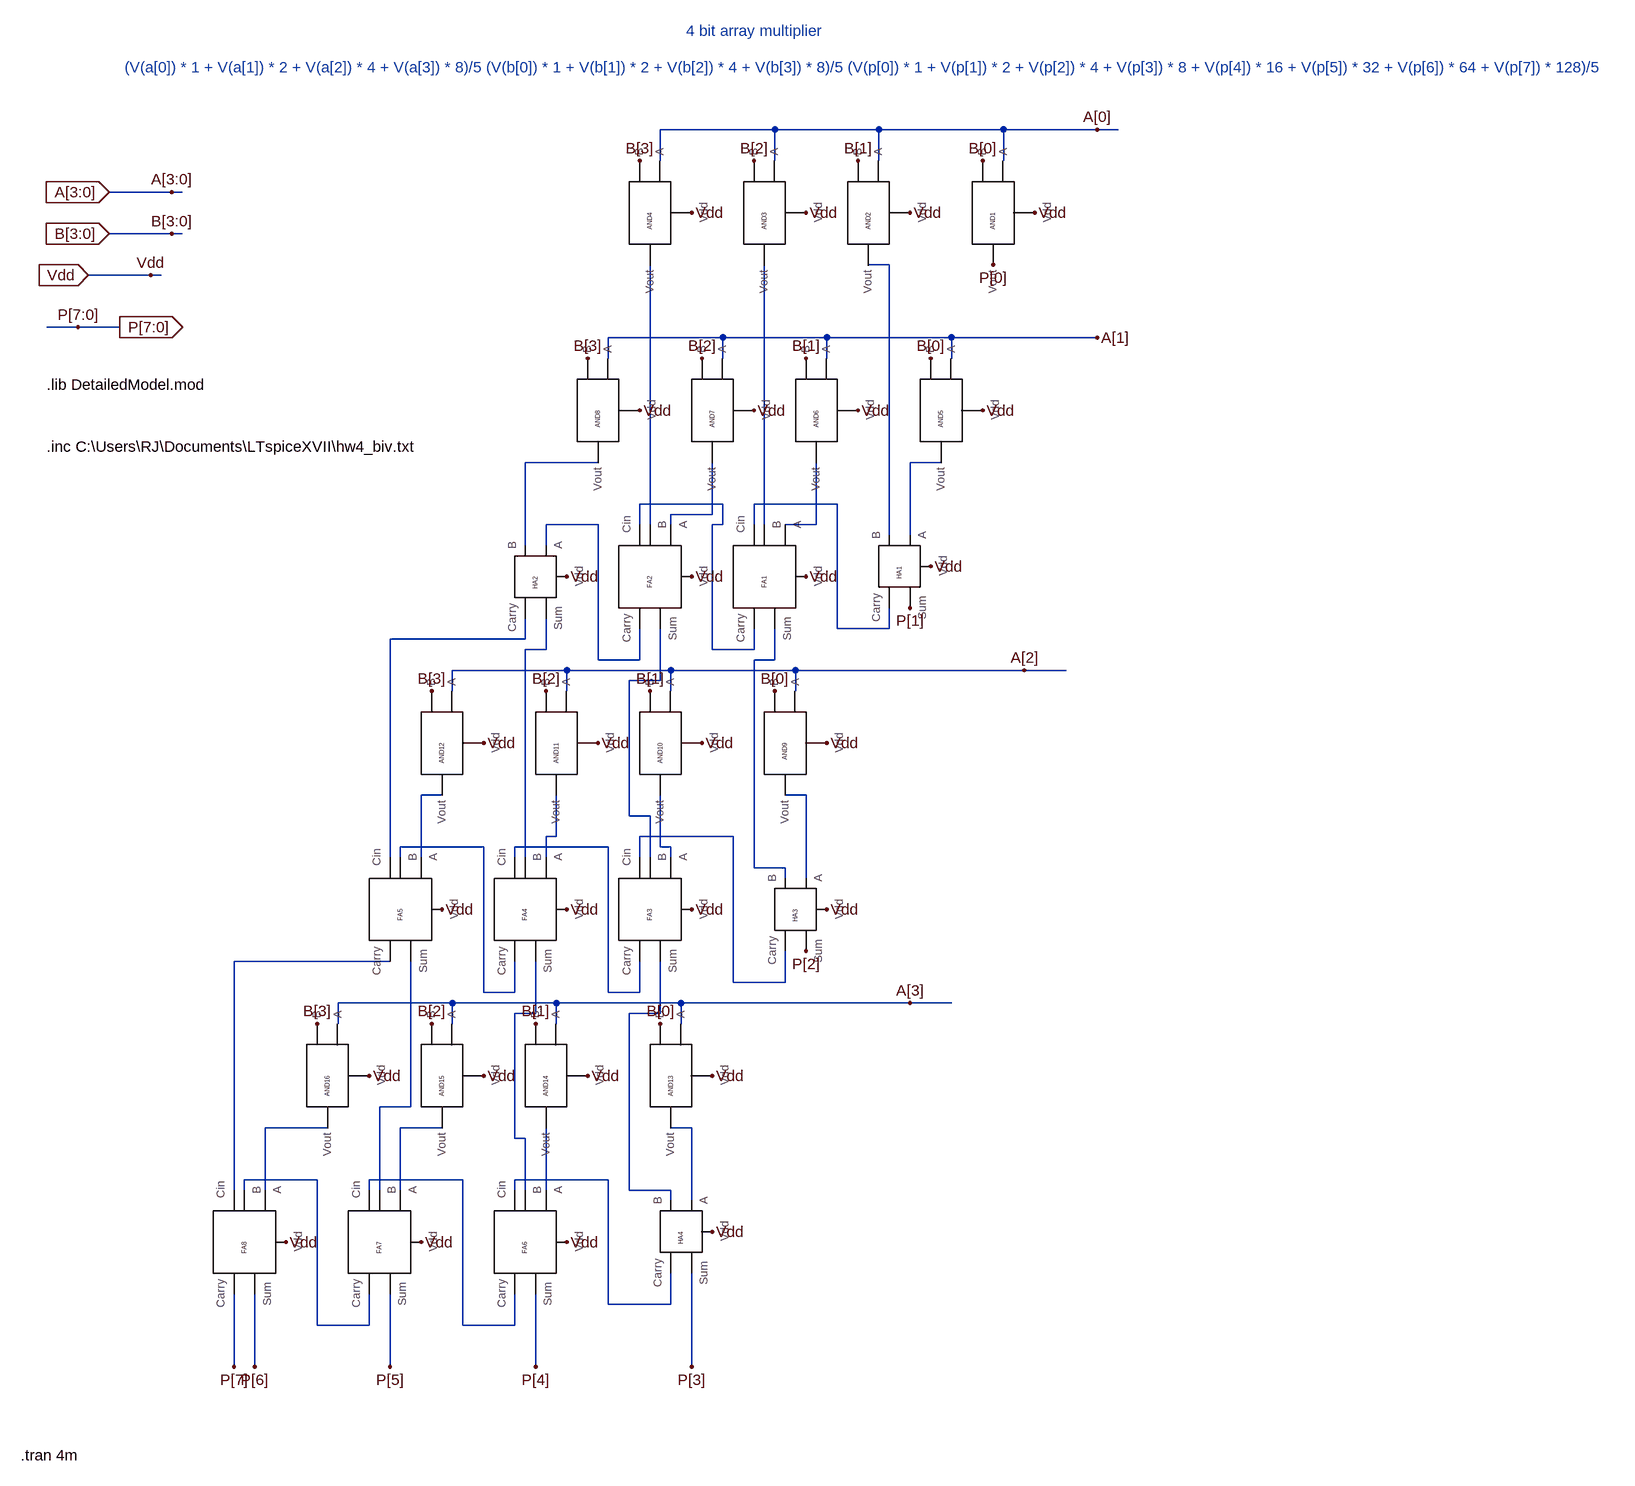
[diagram p0: schematic array_multiplier.asc]
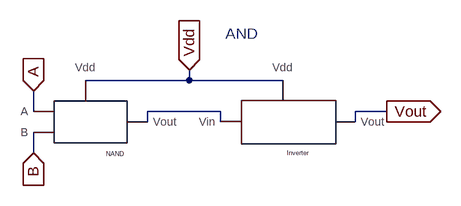
[diagram p1: sub-circuit my_and.asc]
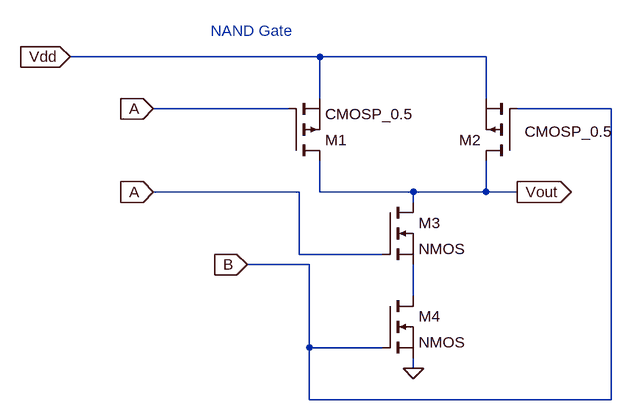
[diagram p2: sub-circuit my_nand.asc]
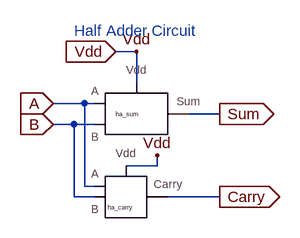
[diagram p3: sub-circuit ha.asc]
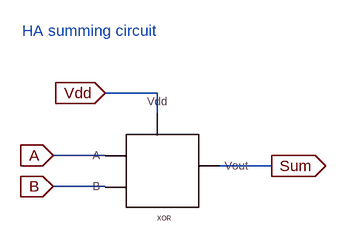
[diagram p4: sub-circuit ha_sum.asc]
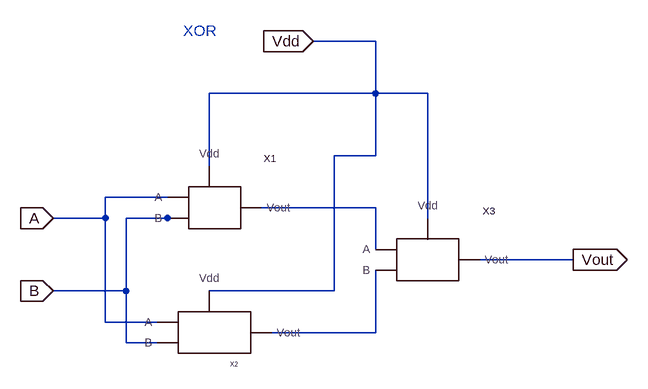
[diagram p5: sub-circuit my_xor.asc]
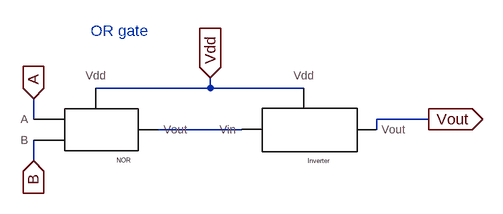
[diagram p6: sub-circuit my_or.asc]
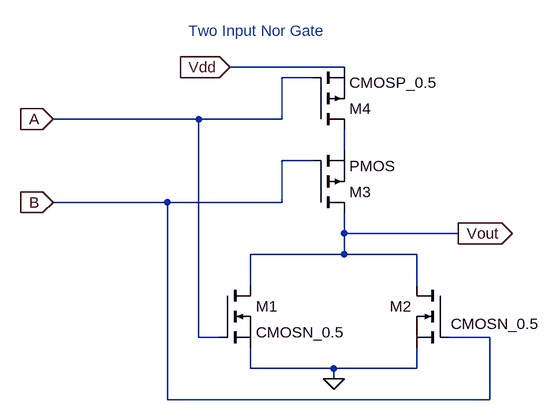
[diagram p7: sub-circuit my_nor.asc]
array_multiplier.asc, the LTspice schematic file:
Version 4
SHEET 1 1696 2024
WIRE -16 -32 -192 -32
WIRE 144 -32 -16 -32
WIRE 336 -32 144 -32
WIRE 480 -32 336 -32
WIRE 512 -32 480 -32
WIRE -192 16 -192 -32
WIRE -16 16 -16 -32
WIRE 144 16 144 -32
WIRE 336 16 336 -32
WIRE -944 64 -1040 64
WIRE -928 64 -944 64
WIRE -944 128 -1040 128
WIRE -928 128 -944 128
WIRE 160 176 128 176
WIRE -976 192 -1072 192
WIRE -960 192 -976 192
WIRE -1088 272 -1136 272
WIRE -1024 272 -1088 272
WIRE -96 288 -272 288
WIRE 64 288 -96 288
WIRE 256 288 64 288
WIRE 480 288 256 288
WIRE -272 320 -272 288
WIRE -96 320 -96 288
WIRE 64 320 64 288
WIRE 256 320 256 288
WIRE -288 480 -400 480
WIRE 240 480 192 480
WIRE -96 544 -224 544
WIRE 80 544 -48 544
WIRE -112 560 -112 480
WIRE -112 560 -176 560
WIRE -288 576 -368 576
WIRE -224 576 -224 544
WIRE -208 576 -208 176
WIRE -176 576 -176 560
WIRE -96 576 -96 544
WIRE -96 576 -112 576
WIRE -48 576 -48 544
WIRE -32 576 -32 176
WIRE 48 576 48 480
WIRE 48 576 0 576
WIRE 160 592 160 176
WIRE 192 592 192 480
WIRE -400 608 -400 480
WIRE -368 608 -368 576
WIRE 80 736 80 544
WIRE 160 736 160 704
WIRE 160 736 80 736
WIRE -400 752 -400 720
WIRE -400 752 -608 752
WIRE -368 768 -368 720
WIRE -368 768 -400 768
WIRE -112 768 -112 576
WIRE -48 768 -48 736
WIRE -48 768 -112 768
WIRE -288 784 -288 576
WIRE -224 784 -224 736
WIRE -224 784 -288 784
WIRE -16 784 -16 736
WIRE -16 784 -48 784
WIRE -336 800 -512 800
WIRE -176 800 -336 800
WIRE 16 800 -176 800
WIRE 368 800 16 800
WIRE 432 800 368 800
WIRE -192 816 -192 736
WIRE -192 816 -240 816
WIRE -512 832 -512 800
WIRE -336 832 -336 800
WIRE -176 832 -176 800
WIRE 16 832 16 800
WIRE -528 992 -560 992
WIRE 32 992 0 992
WIRE -240 1024 -240 816
WIRE -208 1024 -240 1024
WIRE -352 1056 -352 992
WIRE -352 1056 -368 1056
WIRE -80 1056 -224 1056
WIRE -464 1072 -592 1072
WIRE -272 1072 -416 1072
WIRE -192 1072 -192 992
WIRE -176 1072 -192 1072
WIRE -608 1088 -608 752
WIRE -592 1088 -592 1072
WIRE -560 1088 -560 992
WIRE -416 1088 -416 1072
WIRE -400 1088 -400 768
WIRE -368 1088 -368 1056
WIRE -224 1088 -224 1056
WIRE -208 1088 -208 1024
WIRE -176 1088 -176 1072
WIRE -48 1104 -48 784
WIRE 0 1104 -48 1104
WIRE 0 1120 0 1104
WIRE 32 1120 32 992
WIRE -608 1248 -848 1248
WIRE -80 1280 -80 1056
WIRE 0 1280 0 1232
WIRE 0 1280 -80 1280
WIRE -464 1296 -464 1072
WIRE -416 1296 -416 1248
WIRE -416 1296 -464 1296
WIRE -272 1296 -272 1072
WIRE -224 1296 -224 1248
WIRE -224 1296 -272 1296
WIRE -512 1312 -688 1312
WIRE -352 1312 -512 1312
WIRE -160 1312 -352 1312
WIRE 192 1312 -160 1312
WIRE 256 1312 192 1312
WIRE -384 1328 -384 1248
WIRE -384 1328 -416 1328
WIRE -192 1328 -192 1248
WIRE -192 1328 -240 1328
WIRE -688 1344 -688 1312
WIRE -512 1344 -512 1312
WIRE -352 1344 -352 1312
WIRE -160 1344 -160 1312
WIRE -576 1472 -576 1248
WIRE -576 1472 -624 1472
WIRE -704 1504 -800 1504
WIRE -528 1504 -592 1504
WIRE -144 1504 -176 1504
WIRE -416 1520 -416 1328
WIRE -400 1520 -416 1520
WIRE -720 1584 -832 1584
WIRE -496 1584 -640 1584
WIRE -272 1584 -416 1584
WIRE -848 1600 -848 1248
WIRE -832 1600 -832 1584
WIRE -800 1600 -800 1504
WIRE -640 1600 -640 1584
WIRE -624 1600 -624 1472
WIRE -592 1600 -592 1504
WIRE -416 1600 -416 1584
WIRE -400 1600 -400 1520
WIRE -368 1600 -368 1504
WIRE -240 1600 -240 1328
WIRE -176 1600 -240 1600
WIRE -176 1616 -176 1600
WIRE -144 1616 -144 1504
WIRE -272 1776 -272 1584
WIRE -176 1776 -176 1728
WIRE -176 1776 -272 1776
WIRE -720 1808 -720 1584
WIRE -640 1808 -640 1760
WIRE -640 1808 -720 1808
WIRE -496 1808 -496 1584
WIRE -416 1808 -416 1760
WIRE -416 1808 -496 1808
WIRE -848 1872 -848 1760
WIRE -816 1872 -816 1760
WIRE -608 1872 -608 1760
WIRE -384 1872 -384 1760
WIRE -144 1872 -144 1728
FLAG -1040 64 A[3:0]
IOPIN -1040 64 In
FLAG -944 64 A[3:0]
FLAG -1040 128 B[3:0]
IOPIN -1040 128 In
FLAG -944 128 B[3:0]
FLAG -1088 272 P[7:0]
FLAG -1024 272 P[7:0]
IOPIN -1024 272 Out
FLAG 480 -32 A[0]
FLAG 304 16 B[0]
FLAG 112 16 B[1]
FLAG -48 16 B[2]
FLAG -224 16 B[3]
FLAG 480 288 A[1]
FLAG 320 176 P[0]
FLAG -304 320 B[3]
FLAG -128 320 B[2]
FLAG 32 320 B[1]
FLAG 224 320 B[0]
FLAG 192 704 P[1]
FLAG 368 800 A[2]
FLAG -544 832 B[3]
FLAG -368 832 B[2]
FLAG -208 832 B[1]
FLAG -16 832 B[0]
FLAG 192 1312 A[3]
FLAG -720 1344 B[3]
FLAG -544 1344 B[2]
FLAG -384 1344 B[1]
FLAG -192 1344 B[0]
FLAG 32 1232 P[2]
FLAG -848 1872 P[7]
FLAG -816 1872 P[6]
FLAG -144 1872 P[3]
FLAG -608 1872 P[5]
FLAG -384 1872 P[4]
FLAG -768 1680 Vdd
FLAG -560 1680 Vdd
FLAG -336 1680 Vdd
FLAG -112 1664 Vdd
FLAG -112 1424 Vdd
FLAG -304 1424 Vdd
FLAG -464 1424 Vdd
FLAG -640 1424 Vdd
FLAG -528 1168 Vdd
FLAG -336 1168 Vdd
FLAG -144 1168 Vdd
FLAG 64 1168 Vdd
FLAG 64 912 Vdd
FLAG -128 912 Vdd
FLAG -288 912 Vdd
FLAG -464 912 Vdd
FLAG -336 656 Vdd
FLAG -144 656 Vdd
FLAG 32 656 Vdd
FLAG 224 640 Vdd
FLAG 304 400 Vdd
FLAG 112 400 Vdd
FLAG -48 400 Vdd
FLAG -224 400 Vdd
FLAG -144 96 Vdd
FLAG 32 96 Vdd
FLAG 192 96 Vdd
FLAG 384 96 Vdd
FLAG -1072 192 Vdd
IOPIN -1072 192 In
FLAG -976 192 Vdd
SYMBOL my_and 320 96 R90
WINDOW 0 0 0 Left 0
SYMATTR InstName AND1
SYMBOL my_and 128 96 R90
WINDOW 0 0 0 Left 0
SYMATTR InstName AND2
SYMBOL my_and -32 96 R90
WINDOW 0 0 0 Left 0
SYMATTR InstName AND3
SYMBOL my_and -208 96 R90
WINDOW 0 0 0 Left 0
SYMATTR InstName AND4
SYMBOL my_and 240 400 R90
WINDOW 0 0 0 Left 0
SYMATTR InstName AND5
SYMBOL my_and 48 400 R90
WINDOW 0 0 0 Left 0
SYMATTR InstName AND6
SYMBOL my_and -112 400 R90
WINDOW 0 0 0 Left 0
SYMATTR InstName AND7
SYMBOL my_and -288 400 R90
WINDOW 0 0 0 Left 0
SYMATTR InstName AND8
SYMBOL ha 176 640 R90
WINDOW 0 0 0 Left 0
SYMATTR InstName HA1
SYMBOL ha 16 1168 R90
WINDOW 0 0 0 Left 0
SYMATTR InstName HA3
SYMBOL fa -32 656 R90
WINDOW 0 0 0 Left 0
SYMATTR InstName FA1
SYMBOL fa -208 656 R90
WINDOW 0 0 0 Left 0
SYMATTR InstName FA2
SYMBOL fa -208 1168 R90
WINDOW 0 0 0 Left 0
SYMATTR InstName FA3
SYMBOL fa -400 1168 R90
WINDOW 0 0 0 Left 0
SYMATTR InstName FA4
SYMBOL fa -592 1168 R90
WINDOW 0 0 0 Left 0
SYMATTR InstName FA5
SYMBOL my_and 0 912 R90
WINDOW 0 0 0 Left 0
SYMATTR InstName AND9
SYMBOL my_and -192 912 R90
WINDOW 0 0 0 Left 0
SYMATTR InstName AND10
SYMBOL my_and -352 912 R90
WINDOW 0 0 0 Left 0
SYMATTR InstName AND11
SYMBOL my_and -528 912 R90
WINDOW 0 0 0 Left 0
SYMATTR InstName AND12
SYMBOL ha -384 656 R90
WINDOW 0 0 0 Left 0
SYMATTR InstName HA2
SYMBOL my_and -176 1424 R90
WINDOW 0 0 0 Left 0
SYMATTR InstName AND13
SYMBOL my_and -368 1424 R90
WINDOW 0 0 0 Left 0
SYMATTR InstName AND14
SYMBOL my_and -528 1424 R90
WINDOW 0 0 0 Left 0
SYMATTR InstName AND15
SYMBOL my_and -704 1424 R90
WINDOW 0 0 0 Left 0
SYMATTR InstName AND16
SYMBOL ha -160 1664 R90
WINDOW 0 0 0 Left 0
SYMATTR InstName HA4
SYMBOL fa -400 1680 R90
WINDOW 0 0 0 Left 0
SYMATTR InstName FA6
SYMBOL fa -624 1680 R90
WINDOW 0 0 0 Left 0
SYMATTR InstName FA7
SYMBOL fa -832 1680 R90
WINDOW 0 0 0 Left 0
SYMATTR InstName FA8
TEXT -152 -184 Left 2 ;4 bit array multiplier
TEXT -1136 360 Left 2 !.lib DetailedModel.mod
TEXT -1136 456 Left 2 !.inc C:\\Users\\RJ\\Documents\\LTspiceXVII\\hw4_biv.txt
TEXT -1176 2008 Left 2 !.tran 4m
TEXT -1016 -128 Left 2 ;(V(a[0]) * 1 + V(a[1]) * 2 + V(a[2]) * 4 + V(a[3]) * 8)/5 (V(b[0]) * 1 + V(b[1]) * 2 + V(b[2]) * 4 + V(b[3]) * 8)/5 (V(p[0]) * 1 + V(p[1]) * 2 + V(p[2]) * 4 + V(p[3]) * 8 + V(p[4]) * 16 + V(p[5]) * 32 + V(p[6]) * 64 + V(p[7]) * 128)/5

my_and.asc, the sub-circuit schematic file:
Version 4
SHEET 1 880 680
WIRE 288 112 288 96
WIRE 288 112 128 112
WIRE 432 112 288 112
WIRE 48 160 48 128
WIRE 336 160 224 160
WIRE 592 160 544 160
WIRE 224 176 224 160
WIRE 336 176 336 160
WIRE 544 176 544 160
WIRE 48 224 48 192
FLAG 48 128 A
IOPIN 48 128 In
FLAG 48 224 B
IOPIN 48 224 In
FLAG 288 96 Vdd
IOPIN 288 96 In
FLAG 592 160 Vout
IOPIN 592 160 Out
SYMBOL my_nand 128 176 R0
SYMATTR InstName NAND
SYMBOL my_inverter 432 176 R0
SYMATTR InstName Inverter
TEXT 344 40 Left 2 ;AND

my_nand.asc, the sub-circuit schematic file:
Version 4
SHEET 1 932 680
WIRE 480 -16 96 -16
WIRE 736 -16 480 -16
WIRE 480 48 480 -16
WIRE 736 48 736 -16
WIRE 432 64 224 64
WIRE 928 64 784 64
WIRE 448 192 224 192
WIRE 480 192 480 144
WIRE 624 192 480 192
WIRE 736 192 736 144
WIRE 736 192 624 192
WIRE 784 192 736 192
WIRE 624 208 624 192
WIRE 448 288 448 192
WIRE 576 288 448 288
WIRE 464 304 368 304
WIRE 624 352 624 304
WIRE 464 432 464 304
WIRE 576 432 464 432
WIRE 624 464 624 448
WIRE 464 512 464 432
WIRE 928 512 928 64
WIRE 928 512 464 512
FLAG 624 464 0
FLAG 96 -16 Vdd
IOPIN 96 -16 In
FLAG 224 64 A
IOPIN 224 64 In
FLAG 224 192 A
IOPIN 224 192 In
FLAG 368 304 B
IOPIN 368 304 In
FLAG 784 192 Vout
IOPIN 784 192 Out
SYMBOL pmos 432 144 M180
SYMATTR InstName M1
SYMATTR Value CMOSP_0.5
SYMBOL pmos 784 144 R180
WINDOW 3 -11 45 Right 2
SYMATTR Value CMOSP_0.5
SYMATTR InstName M2
SYMBOL nmos 576 208 R0
SYMATTR InstName M3
SYMBOL nmos 576 352 R0
SYMATTR InstName M4
TEXT 312 -56 Left 2 ;NAND Gate

ha.asc, the sub-circuit schematic file:
Version 4
SHEET 1 880 680
WIRE 256 48 224 48
WIRE 256 96 256 48
WIRE 176 128 128 128
WIRE 192 128 176 128
WIRE 384 144 336 144
WIRE 160 160 128 160
WIRE 192 160 160 160
WIRE 288 224 288 208
WIRE 288 224 240 224
WIRE 176 256 176 128
WIRE 192 256 176 256
WIRE 160 272 160 160
WIRE 192 272 160 272
WIRE 384 272 304 272
FLAG 128 128 A
IOPIN 128 128 In
FLAG 128 160 B
IOPIN 128 160 In
FLAG 224 48 Vdd
IOPIN 224 48 In
FLAG 384 144 Sum
IOPIN 384 144 Out
FLAG 384 272 Carry
IOPIN 384 272 Out
FLAG 256 48 Vdd
FLAG 288 208 Vdd
SYMBOL ha_sum 256 144 R0
SYMATTR InstName ha_sum
SYMBOL ha_carry 240 272 R0
SYMATTR InstName ha_carry
TEXT 160 16 Left 2 ;Half Adder Circuit

ha_sum.asc, the sub-circuit schematic file:
Version 4
SHEET 1 880 680
WIRE 208 0 128 0
WIRE 208 32 208 0
WIRE 128 96 48 96
WIRE 384 112 304 112
WIRE 128 144 48 144
FLAG 48 96 A
IOPIN 48 96 In
FLAG 48 144 B
IOPIN 48 144 In
FLAG 128 0 Vdd
IOPIN 128 0 In
FLAG 384 112 Sum
IOPIN 384 112 Out
SYMBOL my_xor 208 112 R0
SYMATTR InstName XOR
TEXT 0 -96 Left 2 ;HA summing circuit

my_xor.asc, the sub-circuit schematic file:
Version 4
SHEET 1 1232 680
WIRE 592 -160 496 -160
WIRE 592 -80 592 -160
WIRE 592 -80 336 -80
WIRE 672 -80 592 -80
WIRE 592 16 592 -80
WIRE 592 16 528 16
WIRE 336 32 336 -80
WIRE 272 80 176 80
WIRE 592 96 416 96
WIRE 176 112 176 80
WIRE 176 112 96 112
WIRE 272 112 208 112
WIRE 288 112 272 112
WIRE 672 112 672 -80
WIRE 592 160 592 96
WIRE 896 176 752 176
WIRE 208 224 208 112
WIRE 208 224 96 224
WIRE 528 224 528 16
WIRE 528 224 336 224
WIRE 176 272 176 112
WIRE 256 272 176 272
WIRE 592 288 592 192
WIRE 592 288 432 288
WIRE 208 304 208 224
WIRE 256 304 208 304
FLAG 96 112 A
IOPIN 96 112 In
FLAG 96 224 B
IOPIN 96 224 In
FLAG 496 -160 Vdd
IOPIN 496 -160 In
FLAG 896 176 Vout
IOPIN 896 176 Out
SYMBOL my_or 336 80 R0
SYMATTR InstName X1
SYMBOL my_nand 336 288 R0
SYMATTR InstName X2
SYMBOL my_and 672 176 R0
SYMATTR InstName X3
TEXT 296 -176 Left 2 ;XOR

my_or.asc, the sub-circuit schematic file:
Version 4
SHEET 1 880 680
WIRE 288 144 288 128
WIRE 288 144 112 144
WIRE 432 144 288 144
WIRE 16 192 16 160
WIRE 624 192 544 192
WIRE 336 208 208 208
WIRE 544 208 544 192
WIRE 16 256 16 224
FLAG 16 160 A
IOPIN 16 160 In
FLAG 16 256 B
IOPIN 16 256 In
FLAG 288 128 Vdd
IOPIN 288 128 In
FLAG 624 192 Vout
IOPIN 624 192 Out
SYMBOL my_nor 112 208 R0
SYMATTR InstName NOR
SYMBOL my_inverter 432 208 R0
SYMATTR InstName Inverter
TEXT 104 56 Left 2 ;OR gate

my_nor.asc, the sub-circuit schematic file:
Version 4
SHEET 1 880 680
WIRE 336 -240 160 -240
WIRE 288 -224 240 -224
WIRE 112 -160 -112 -160
WIRE 240 -160 240 -224
WIRE 240 -160 112 -160
WIRE 336 -112 336 -144
WIRE 288 -96 240 -96
WIRE 64 -32 -112 -32
WIRE 240 -32 240 -96
WIRE 240 -32 64 -32
WIRE 336 16 336 -16
WIRE 512 16 336 16
WIRE 336 48 336 16
WIRE 336 48 192 48
WIRE 448 48 336 48
WIRE 192 96 192 48
WIRE 448 96 448 48
WIRE 112 176 112 -160
WIRE 144 176 112 176
WIRE 560 176 496 176
WIRE 192 224 192 192
WIRE 320 224 192 224
WIRE 448 224 448 192
WIRE 448 224 320 224
WIRE 320 240 320 224
WIRE 64 272 64 -32
WIRE 560 272 560 176
WIRE 560 272 64 272
FLAG -112 -32 B
IOPIN -112 -32 In
FLAG -112 -160 A
IOPIN -112 -160 In
FLAG 160 -240 Vdd
IOPIN 160 -240 In
FLAG 512 16 Vout
IOPIN 512 16 Out
FLAG 320 240 0
SYMBOL nmos 144 96 R0
SYMATTR InstName M1
SYMATTR Value CMOSN_0.5
SYMBOL nmos 496 96 M0
WINDOW 3 -141 59 Left 2
SYMATTR Value CMOSN_0.5
SYMATTR InstName M2
SYMBOL pmos 288 -144 M180
SYMATTR InstName M4
SYMATTR Value CMOSP_0.5
SYMBOL pmos 288 -16 M180
SYMATTR InstName M3
TEXT 96 -296 Left 2 ;Two Input Nor Gate

ha_carry.asc, the sub-circuit schematic file:
Version 4
SHEET 1 880 680
WIRE 192 -32 144 -32
WIRE 192 -16 192 -32
WIRE 112 32 48 32
WIRE 368 48 272 48
WIRE 112 64 48 64
FLAG 48 32 A
IOPIN 48 32 In
FLAG 48 64 B
IOPIN 48 64 In
FLAG 144 -32 Vdd
IOPIN 144 -32 In
FLAG 368 48 Carry
IOPIN 368 48 Out
SYMBOL my_and 192 48 R0
WINDOW 0 0 0 Left 0
SYMATTR InstName AND1
TEXT 120 -96 Left 2 ;HA carry circuit

fa.asc, the sub-circuit schematic file:
Version 4
SHEET 1 880 680
WIRE 128 -32 80 -32
WIRE 176 -32 128 -32
WIRE 176 16 176 -32
WIRE 176 32 176 16
WIRE 80 48 16 48
WIRE 112 48 80 48
WIRE 304 64 256 64
WIRE 64 80 32 80
WIRE 112 80 64 80
WIRE 112 96 48 96
WIRE 32 112 32 80
WIRE 32 112 16 112
WIRE 48 176 48 96
WIRE 48 176 16 176
WIRE 208 176 208 160
WIRE 208 176 160 176
WIRE 80 208 80 48
WIRE 112 208 80 208
WIRE 304 224 240 224
WIRE 64 240 64 80
WIRE 112 240 64 240
WIRE 48 256 48 176
WIRE 112 256 48 256
FLAG 16 48 A
IOPIN 16 48 In
FLAG 16 112 B
IOPIN 16 112 In
FLAG 16 176 Cin
IOPIN 16 176 In
FLAG 80 -32 Vdd
IOPIN 80 -32 In
FLAG 128 -32 Vdd
FLAG 208 160 Vdd
FLAG 304 64 Sum
IOPIN 304 64 Out
FLAG 304 224 Carry
IOPIN 304 224 Out
SYMBOL fa_sum 160 64 R0
SYMATTR InstName fa_sum
SYMBOL fa_carry 160 224 R0
SYMATTR InstName fa_carry
TEXT 160 -80 Left 2 ;Full Adder Circuit

fa_sum.asc, the sub-circuit schematic file:
Version 4
SHEET 1 880 680
WIRE 320 32 128 32
WIRE 320 96 320 32
WIRE 320 96 176 96
WIRE 112 128 64 128
WIRE 112 160 64 160
WIRE 320 176 320 96
WIRE 352 176 320 176
WIRE 256 208 256 144
WIRE 288 208 256 208
WIRE 464 224 432 224
WIRE 288 240 80 240
FLAG 64 128 A
IOPIN 64 128 In
FLAG 64 160 B
IOPIN 64 160 In
FLAG 80 240 Cin
IOPIN 80 240 In
FLAG 464 224 Sum
IOPIN 464 224 Out
FLAG 128 32 Vdd
IOPIN 128 32 In
SYMBOL ha_sum 176 144 R0
SYMATTR InstName HA_sum1
SYMBOL ha_sum 352 224 R0
SYMATTR InstName HA_sum2
TEXT 168 -72 Left 2 ;FA summing circuit

fa_carry.asc, the sub-circuit schematic file:
Version 4
SHEET 1 1564 680
WIRE 32 96 -16 96
WIRE 192 128 112 128
WIRE 576 144 496 144
WIRE 96 192 16 192
WIRE 384 192 304 192
WIRE 416 192 384 192
WIRE 512 192 416 192
WIRE 752 208 656 208
WIRE 512 224 384 224
WIRE 128 288 112 288
WIRE 192 288 128 288
WIRE 576 304 496 304
WIRE 1072 304 816 304
WIRE 752 336 752 208
WIRE 96 352 16 352
WIRE 384 352 384 224
WIRE 384 352 304 352
WIRE 512 352 384 352
WIRE 752 368 656 368
WIRE 512 384 432 384
WIRE 192 448 112 448
WIRE 1072 448 1072 304
WIRE 1232 448 1072 448
WIRE 592 464 496 464
WIRE 1072 464 1072 448
WIRE 1072 464 992 464
WIRE 896 496 896 352
WIRE 928 496 896 496
WIRE 96 512 16 512
WIRE 320 512 304 512
WIRE 432 512 432 384
WIRE 432 512 320 512
WIRE 528 512 432 512
WIRE 1136 512 1072 512
WIRE 1440 512 1344 512
WIRE 928 528 672 528
WIRE 416 544 416 192
WIRE 528 544 416 544
FLAG 16 192 A
IOPIN 16 192 In
FLAG 16 352 B
IOPIN 16 352 In
FLAG 16 512 Cin
IOPIN 16 512 In
FLAG 304 352 Bbar
FLAG 384 192 Abar
FLAG 320 512 Cbar
FLAG 1440 512 Carry
IOPIN 1440 512 Out
FLAG -16 96 Vdd
IOPIN -16 96 In
FLAG 1072 304 Vdd
FLAG 496 144 Vdd
FLAG 496 304 Vdd
FLAG 496 464 Vdd
FLAG 112 448 Vdd
FLAG 128 288 Vdd
FLAG 112 128 Vdd
FLAG 32 96 Vdd
SYMBOL my_inverter 192 192 R0
SYMATTR InstName inverter1
SYMBOL my_inverter 192 352 R0
SYMATTR InstName inverter2
SYMBOL my_inverter 192 512 R0
SYMATTR InstName inverter3
SYMBOL my_or 576 192 R0
WINDOW 0 0 0 Left 0
SYMATTR InstName or1
SYMBOL my_or 576 352 R0
WINDOW 0 0 0 Left 0
SYMATTR InstName or2
SYMBOL my_or 592 512 R0
WINDOW 0 0 0 Left 0
SYMATTR InstName or3
SYMBOL ha_sum 816 352 R0
SYMATTR InstName ha_sum1
SYMBOL ha_sum 992 512 R0
SYMATTR InstName ha_sum2
SYMBOL my_inverter 1232 512 R0
SYMATTR InstName inverter4
TEXT 824 144 Left 2 ;FA carry circuit

The netlist it stands for:
* array_multiplier.asc
XAND1 A[0] B[0] P[0] Vdd my_and
XAND2 A[0] B[1] N001 Vdd my_and
XAND3 A[0] B[2] N009 Vdd my_and
XAND4 A[0] B[3] N008 Vdd my_and
XAND5 A[1] B[0] N003 Vdd my_and
XAND6 A[1] B[1] N010 Vdd my_and
XAND7 A[1] B[2] N006 Vdd my_and
XAND8 A[1] B[3] N002 Vdd my_and
XHA1 N003 N001 Vdd P[1] N005 ha
XHA3 N016 N013 Vdd P[2] N018 ha
XFA1 N010 N009 N005 N013 N004 Vdd fa
XFA2 N006 N008 N004 N014 N007 Vdd fa
XFA3 N021 N014 N018 N024 N020 Vdd fa
XFA4 N017 N012 N020 N023 N019 Vdd fa
XFA5 N015 N019 N011 N025 N022 Vdd fa
XAND9 A[2] B[0] N016 Vdd my_and
XAND10 A[2] B[1] N021 Vdd my_and
XAND11 A[2] B[2] N017 Vdd my_and
XAND12 A[2] B[3] N015 Vdd my_and
XHA2 N007 N002 Vdd N012 N011 ha
XAND13 A[3] B[0] N028 Vdd my_and
XAND14 A[3] B[1] N032 Vdd my_and
XAND15 A[3] B[2] N027 Vdd my_and
XAND16 A[3] B[3] N026 Vdd my_and
XHA4 N028 N024 Vdd P[3] N031 ha
XFA6 N032 N023 N031 P[4] N030 Vdd fa
XFA7 N027 N025 N030 P[5] N029 Vdd fa
XFA8 N026 N029 N022 P[6] P[7] Vdd fa

* block symbol definitions
.subckt my_and A B Vout Vdd
XNAND A B N001 Vdd my_nand
XInverter N001 Vdd Vout my_inverter  ; pins Vin Vdd Vout
* AND
.ends my_and

.subckt my_nand A B Vout Vdd
M1 Vout A Vdd Vdd CMOSP_0.5
M2 Vout B Vdd Vdd CMOSP_0.5
M3 Vout A N001 N001 NMOS
M4 N001 B 0 0 NMOS
* NAND Gate
.ends my_nand

.subckt ha A B Vdd Sum Carry
Xha_sum A B Sum Vdd ha_sum
Xha_carry A B Carry Vdd ha_carry
* Half Adder Circuit
.ends ha

.subckt ha_sum A B Sum Vdd
XXOR A B Vdd Sum my_xor
* HA summing circuit
.ends ha_sum

.subckt my_xor A B Vdd Vout
XX1 A B Vdd N001 my_or
XX2 A B N002 Vdd my_nand
XX3 N001 N002 Vout Vdd my_and
* XOR
.ends my_xor

.subckt my_or A B Vdd Vout
XNOR A B N001 Vdd my_nor
XInverter N001 Vdd Vout my_inverter  ; pins Vin Vdd Vout
* OR gate
.ends my_or

.subckt my_nor A B Vout Vdd
M1 Vout A 0 0 CMOSN_0.5
M2 Vout B 0 0 CMOSN_0.5
M4 N001 A Vdd Vdd CMOSP_0.5
M3 Vout B N001 N001 PMOS
* Two Input Nor Gate
.ends my_nor

.subckt ha_carry A B Carry Vdd
XAND1 A B Carry Vdd my_and
* HA carry circuit
.ends ha_carry

.subckt fa A B Cin Sum Carry Vdd
Xfa_sum A B Cin Sum Vdd fa_sum
Xfa_carry A B Cin Carry Vdd fa_carry
* Full Adder Circuit
.ends fa

.subckt fa_sum A B Cin Sum Vdd
XHA_sum1 A B N001 Vdd ha_sum
XHA_sum2 N001 Cin Sum Vdd ha_sum
* FA summing circuit
.ends fa_sum

.subckt fa_carry A B Cin Carry Vdd
Xinverter1 A Vdd Abar my_inverter  ; pins Vin Vdd Vout
Xinverter2 B Vdd Bbar my_inverter  ; pins Vin Vdd Vout
Xinverter3 Cin Vdd Cbar my_inverter  ; pins Vin Vdd Vout
Xor1 Abar Bbar Vdd N001 my_or
Xor2 Bbar Cbar Vdd N002 my_or
Xor3 Cbar Abar Vdd N005 my_or
Xha_sum1 N001 N002 N003 Vdd ha_sum
Xha_sum2 N003 N005 N004 Vdd ha_sum
Xinverter4 N004 Vdd Carry my_inverter  ; pins Vin Vdd Vout
* FA carry circuit
.ends fa_carry

.model NMOS NMOS
.model PMOS PMOS
.lib standard.mos
* 4 bit array multiplier
.lib DetailedModel.mod
.inc C:\Users\RJ\Documents\LTspiceXVII\hw4_biv.txt
.tran 4m
* (V(a[0]) * 1 + V(a[1]) * 2 + V(a[2]) * 4 + V(a[3]) * 8)/5 (V(b[0]) * 1 + V(b[1]) * 2 + V(b[2]) * 4 + V(b[3]) * 8)/5 (V(p[0]) * 1 + V(p[1]) * 2 + V(p[2]) * 4 + V(p[3]) * 8 + V(p[4]) * 16 + V(p[5]) * 32 + V(p[6]) * 64 + V(p[7]) * 128)/5
.backanno
.end